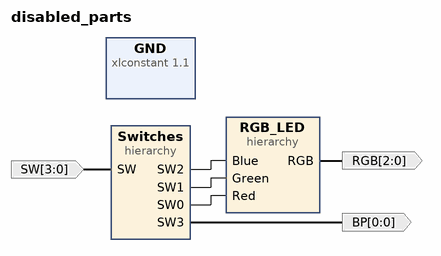
[diagram p0: block diagram of the top level]
# Vivado block design disabled_parts, xc7z020clg400-1, Vivado 2024.2.1
create_bd_design disabled_parts

create_bd_port -dir O -from 0 -to 0 BP
create_bd_port -dir O -from 2 -to 0 RGB
create_bd_port -dir I -from 3 -to 0 SW

create_bd_cell -type hier RGB_LED
create_bd_cell -type hier Switches
create_bd_cell -type ip -vlnv xilinx.com:ip:xlconstant:1.1 GND
set_property -dict {CONFIG.CONST_VAL 0} [get_bd_cells GND]

# ---- hierarchy /RGB_LED ----
current_bd_instance /RGB_LED
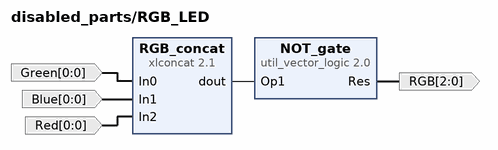
[diagram p1: block diagram inside /RGB_LED]
create_bd_pin -dir O -from 2 -to 0 RGB
create_bd_pin -dir I -from 0 -to 0 Green
create_bd_pin -dir I -from 0 -to 0 Red
create_bd_pin -dir I -from 0 -to 0 Blue

create_bd_cell -type ip -vlnv xilinx.com:ip:xlconcat:2.1 RGB_concat
set_property -dict {CONFIG.NUM_PORTS 3} [get_bd_cells RGB_concat]
create_bd_cell -type ip -vlnv xilinx.com:ip:util_vector_logic:2.0 NOT_gate
set_property -dict {CONFIG.C_OPERATION not CONFIG.C_SIZE 3} [get_bd_cells NOT_gate]

# ---- hierarchy /Switches ----
current_bd_instance /Switches
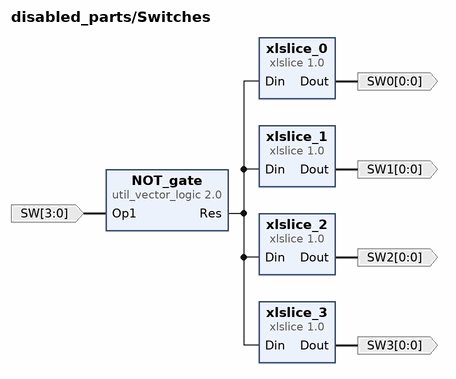
[diagram p2: block diagram inside /Switches]
create_bd_pin -dir I -from 3 -to 0 SW
create_bd_pin -dir O -from 0 -to 0 SW0
create_bd_pin -dir O -from 0 -to 0 SW1
create_bd_pin -dir O -from 0 -to 0 SW2
create_bd_pin -dir O -from 0 -to 0 SW3

create_bd_cell -type ip -vlnv xilinx.com:ip:xlslice:1.0 xlslice_3
set_property -dict {CONFIG.DIN_FROM 0 CONFIG.DIN_TO 0 CONFIG.DIN_WIDTH 4} [get_bd_cells xlslice_3]
create_bd_cell -type ip -vlnv xilinx.com:ip:xlslice:1.0 xlslice_2
set_property -dict {CONFIG.DIN_FROM 1 CONFIG.DIN_TO 1 CONFIG.DIN_WIDTH 4} [get_bd_cells xlslice_2]
create_bd_cell -type ip -vlnv xilinx.com:ip:xlslice:1.0 xlslice_1
set_property -dict {CONFIG.DIN_FROM 2 CONFIG.DIN_TO 2 CONFIG.DIN_WIDTH 4} [get_bd_cells xlslice_1]
create_bd_cell -type ip -vlnv xilinx.com:ip:xlslice:1.0 xlslice_0
set_property -dict {CONFIG.DIN_FROM 3 CONFIG.DIN_TO 3 CONFIG.DIN_WIDTH 4} [get_bd_cells xlslice_0]
create_bd_cell -type ip -vlnv xilinx.com:ip:util_vector_logic:2.0 NOT_gate
set_property -dict {CONFIG.C_OPERATION not CONFIG.C_SIZE 4} [get_bd_cells NOT_gate]

# ---- connections ----

current_bd_instance /RGB_LED
connect_bd_net -net In0_1 [get_bd_pins Green] [get_bd_pins RGB_concat/In0]
connect_bd_net -net In1_1 [get_bd_pins Blue] [get_bd_pins RGB_concat/In1]
connect_bd_net -net In2_1 [get_bd_pins Red] [get_bd_pins RGB_concat/In2]
connect_bd_net -net concatenation_dout [get_bd_pins RGB_concat/dout] [get_bd_pins NOT_gate/Op1]
connect_bd_net -net util_vector_logic_0_Res [get_bd_pins NOT_gate/Res] [get_bd_pins RGB]

current_bd_instance /Switches
connect_bd_net [get_bd_pins NOT_gate/Res] \
  [get_bd_pins xlslice_3/Din] [get_bd_pins xlslice_2/Din] [get_bd_pins xlslice_1/Din] [get_bd_pins xlslice_0/Din]
connect_bd_net [get_bd_pins SW] [get_bd_pins NOT_gate/Op1]
connect_bd_net [get_bd_pins xlslice_0/Dout] [get_bd_pins SW0]
connect_bd_net [get_bd_pins xlslice_1/Dout] [get_bd_pins SW1]
connect_bd_net [get_bd_pins xlslice_2/Dout] [get_bd_pins SW2]
connect_bd_net [get_bd_pins xlslice_3/Dout] [get_bd_pins SW3]

current_bd_instance /
connect_bd_net -net Blue_1 [get_bd_pins Switches/SW2] [get_bd_pins RGB_LED/Blue]
connect_bd_net -net Green_1 [get_bd_pins Switches/SW1] [get_bd_pins RGB_LED/Green]
connect_bd_net -net RGB_LED_LEDS [get_bd_pins RGB_LED/RGB] [get_bd_ports RGB]
connect_bd_net -net Red_1 [get_bd_pins Switches/SW0] [get_bd_pins RGB_LED/Red]
connect_bd_net [get_bd_ports SW] [get_bd_pins Switches/SW]
connect_bd_net [get_bd_pins Switches/SW3] [get_bd_ports BP]

validate_bd_design
save_bd_design
